# EAGLE design singleLimit (EAGLE 9.6.2)
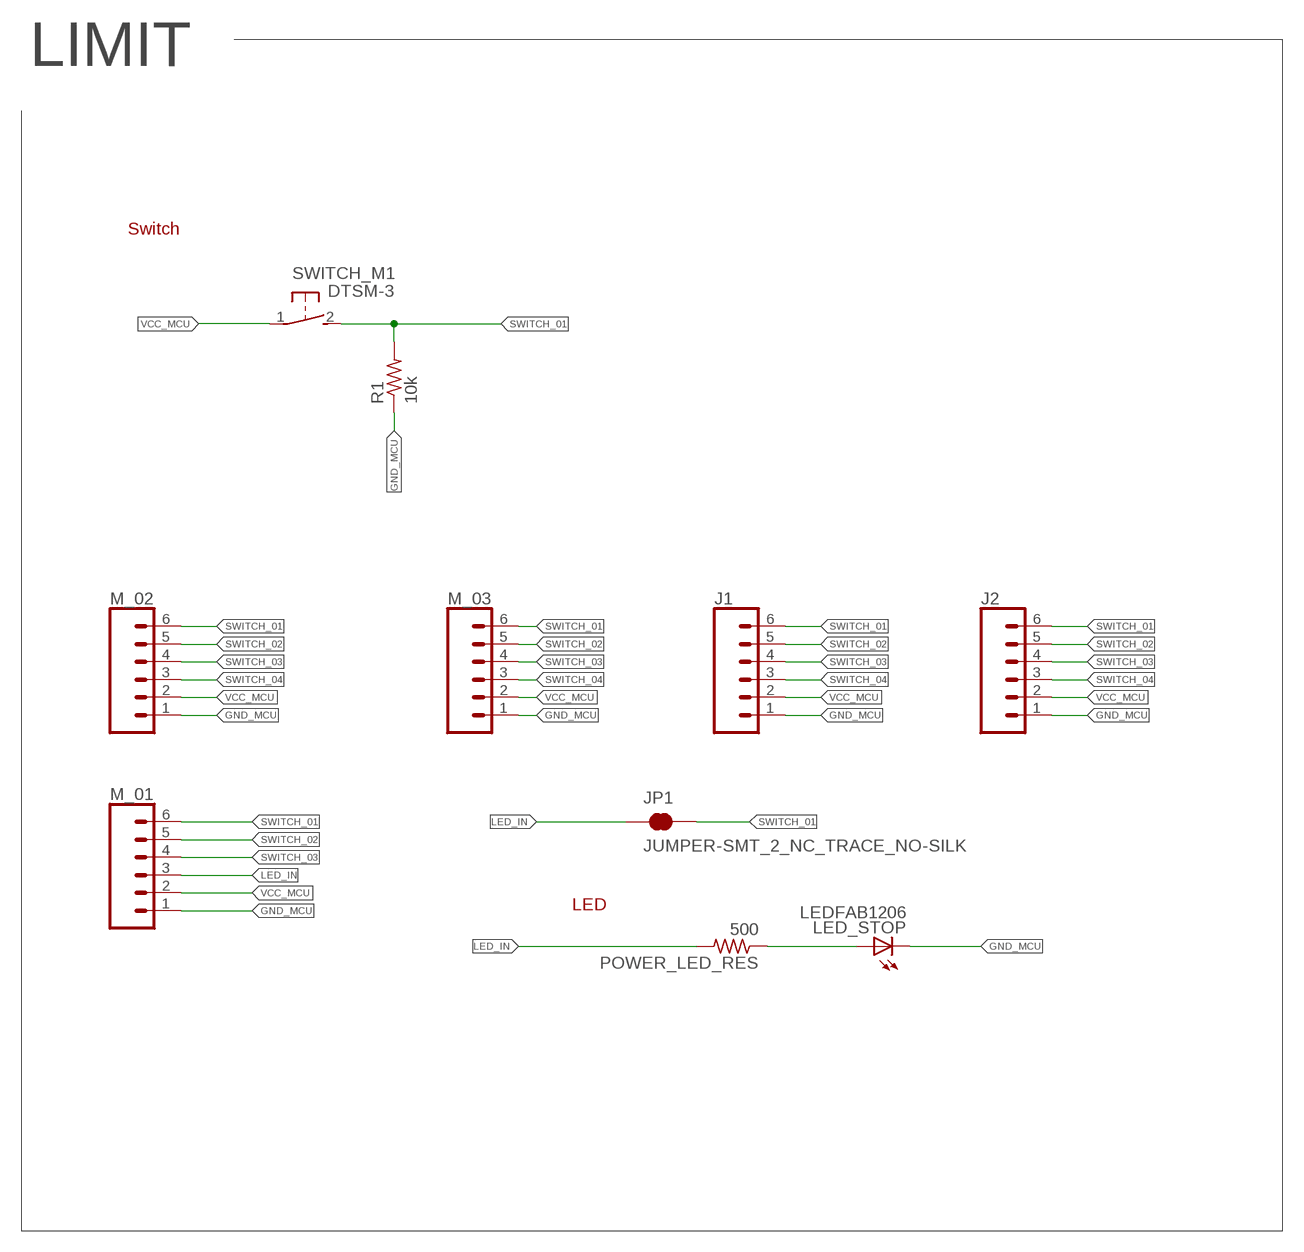
[diagram p0: schematic, sheet 1]

## Parts
J1  CONN_06NO_SILK_FEMALE_PTH  [1X06_NO_SILK]
J2  CONN_06NO_SILK_FEMALE_PTH  [1X06_NO_SILK]
JP1  JUMPER-SMT_2_NC_TRACE_NO-SILK  [SMT-JUMPER_2_NC_TRACE_NO-SILK]
LED_STOP  LEDFAB1206  [LED1206FAB]
M_01  CONN_06SMD-1MM  [1X06-1MM]
M_02  CONN_06SMD-1MM  [1X06-1MM]
M_03  CONN_06SMD-1MM  [1X06-1MM]
POWER_LED_RES  500  R-US_M0805  [M0805]
R1  10k  R-US_M0805  [M0805]
SWITCH_M1  DTSM-3  [DTSM-3]

## Nets
GND_MCU: J1.1 J2.1 LED_STOP.2(C) M_01.1 M_02.1 M_03.1 R1.1
LED_IN: JP1.1 M_01.3 POWER_LED_RES.2
N$11: LED_STOP.1(A) POWER_LED_RES.1
SWITCH_01: J1.6 J2.6 JP1.2 M_01.6 M_02.6 M_03.6 R1.2 SWITCH_M1.2
SWITCH_02: J1.5 J2.5 M_01.5 M_02.5 M_03.5
SWITCH_03: J1.4 J2.4 M_01.4 M_02.4 M_03.4
SWITCH_04: J1.3 J2.3 M_02.3 M_03.3
VCC_MCU: J1.2 J2.2 M_01.2 M_02.2 M_03.2 SWITCH_M1.1

## Notes on the sheet
- LIMIT
- Switch
- LED

## Library data of the parts
J1 J2 = SparkFun-Connectors:CONN_06: Multi connection point. Often used as Generic Header-pin footprint for 0.1 inch spaced/style header connections On any of the 0.1 inch spaced packages, you can populate with these: Break Away Headers - Straight <https://www.sparkfun.com/products/116> (PRT-00116) Break Away Male Headers - Right Angle <https://www.sparkfun.com/products/553> (PRT-00553) Female Headers <https://www.sparkfun.com/products/115> (PRT-00115) Break Away Headers - Machine Pin <https://www.sparkfun.com/products/117> (PRT-00117) Break Away Female Headers - Swiss Machine Pin <https://www.sparkfun.com/products/743> (PRT-00743) Arduino Stackable Header - 6 Pin <https://www.sparkfun.com/products/9280> (PRT-09280) For SCREWTERMINALS and SPRING TERMINALS visit here: Screw Terimnals on SparkFun.com <https://www.sparkfun.com/search/results?term=Screw+Terminals> (5mm/3.5mm/2.54mm spacing) This device is also useful as a general connection point to wire up your design to another part of your project. Our various solder wires solder well into these plated through hole pads. Hook-Up Wire - Assortment (Stranded, 22 AWG) <https://www.sparkfun.com/products/11375> (PRT-11375) Hook-Up Wire - Assortment (Solid Core, 22 AWG) <https://www.sparkfun.com/products/11367> (PRT-11367) View the entire wire category on our website here <https://www.sparkfun.com/categories/141>; PROD_ID: CONN-08437
JP1 = SparkFun-Jumpers:JUMPER-SMT_2_NC_TRACE: Normally closed trace jumper This jumper has a trace between two pads so it's normally closed (NC). Use a razor knife to open the connection. For best results follow the IPC guidelines for cutting traces: Cutout at least 0.063 mm (0.005 in). Remove all loose material to clean up the cut area. Seal the cut with an approved epoxy. Reapply solder to reclose the connection.
LED_STOP = fab:LED: LED
M_01-M_03 = SparkFun-Connectors:CONN_06: Multi connection point. Often used as Generic Header-pin footprint for 0.1 inch spaced/style header connections On any of the 0.1 inch spaced packages, you can populate with these: Break Away Headers - Straight <https://www.sparkfun.com/products/116> (PRT-00116) Break Away Male Headers - Right Angle <https://www.sparkfun.com/products/553> (PRT-00553) Female Headers <https://www.sparkfun.com/products/115> (PRT-00115) Break Away Headers - Machine Pin <https://www.sparkfun.com/products/117> (PRT-00117) Break Away Female Headers - Swiss Machine Pin <https://www.sparkfun.com/products/743> (PRT-00743) Arduino Stackable Header - 6 Pin <https://www.sparkfun.com/products/9280> (PRT-09280) For SCREWTERMINALS and SPRING TERMINALS visit here: Screw Terimnals on SparkFun.com <https://www.sparkfun.com/search/results?term=Screw+Terminals> (5mm/3.5mm/2.54mm spacing) This device is also useful as a general connection point to wire up your design to another part of your project. Our various solder wires solder well into these plated through hole pads. Hook-Up Wire - Assortment (Stranded, 22 AWG) <https://www.sparkfun.com/products/11375> (PRT-11375) Hook-Up Wire - Assortment (Solid Core, 22 AWG) <https://www.sparkfun.com/products/11367> (PRT-11367) View the entire wire category on our website here <https://www.sparkfun.com/categories/141>; PROD_ID: CONN-08249; SF_ID: GPS-00579
POWER_LED_RES R1 = resistor:R-US_: RESISTOR, American symbol
SWITCH_M1 = switch-tact:DTSM-3

## Net classes
0 default: width 0.2 mm, clearance 0.2 mm

## Board
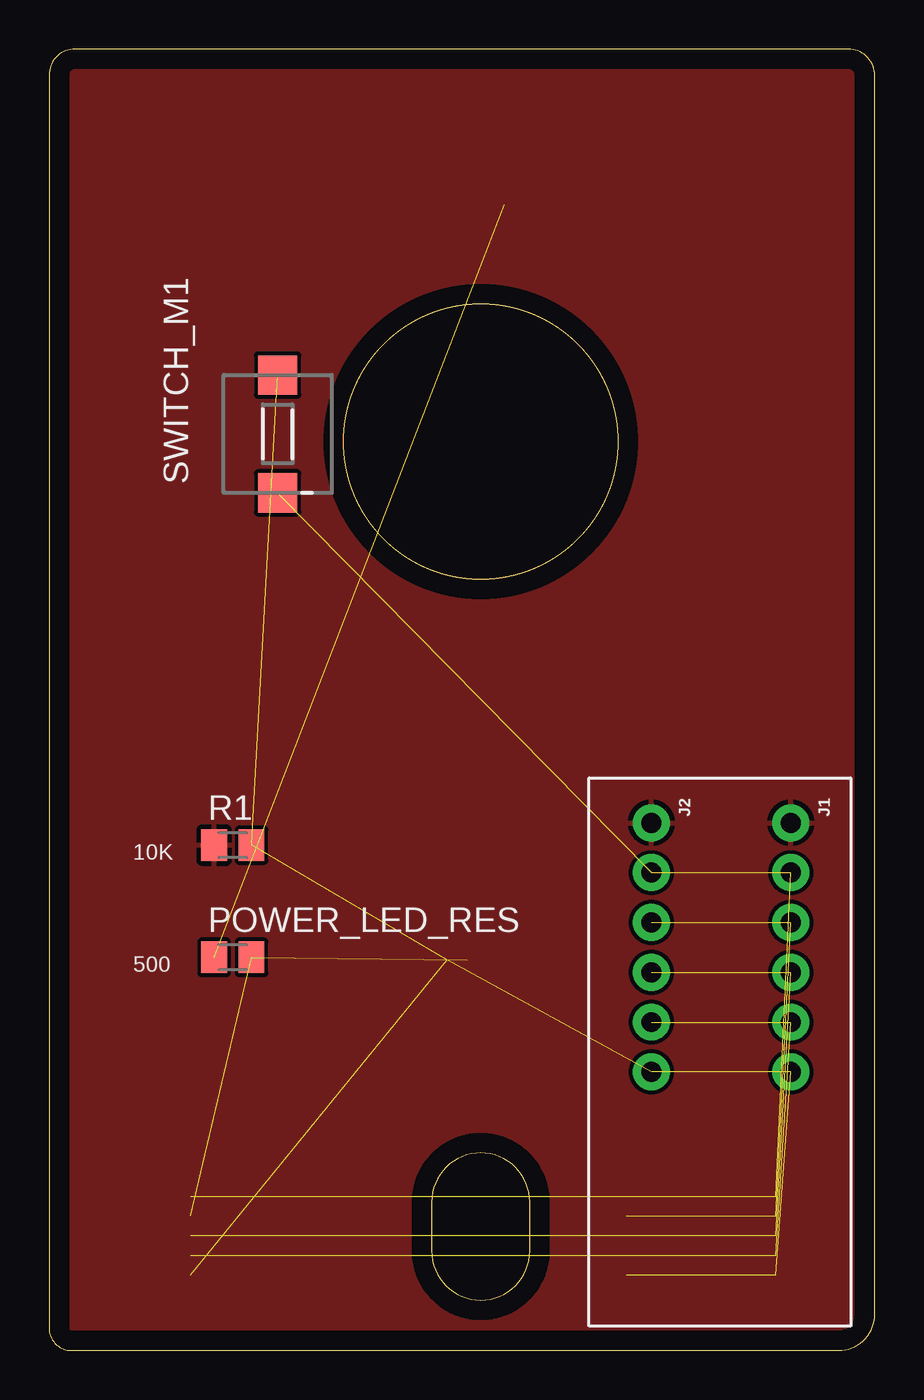
[diagram p1: board, top side]
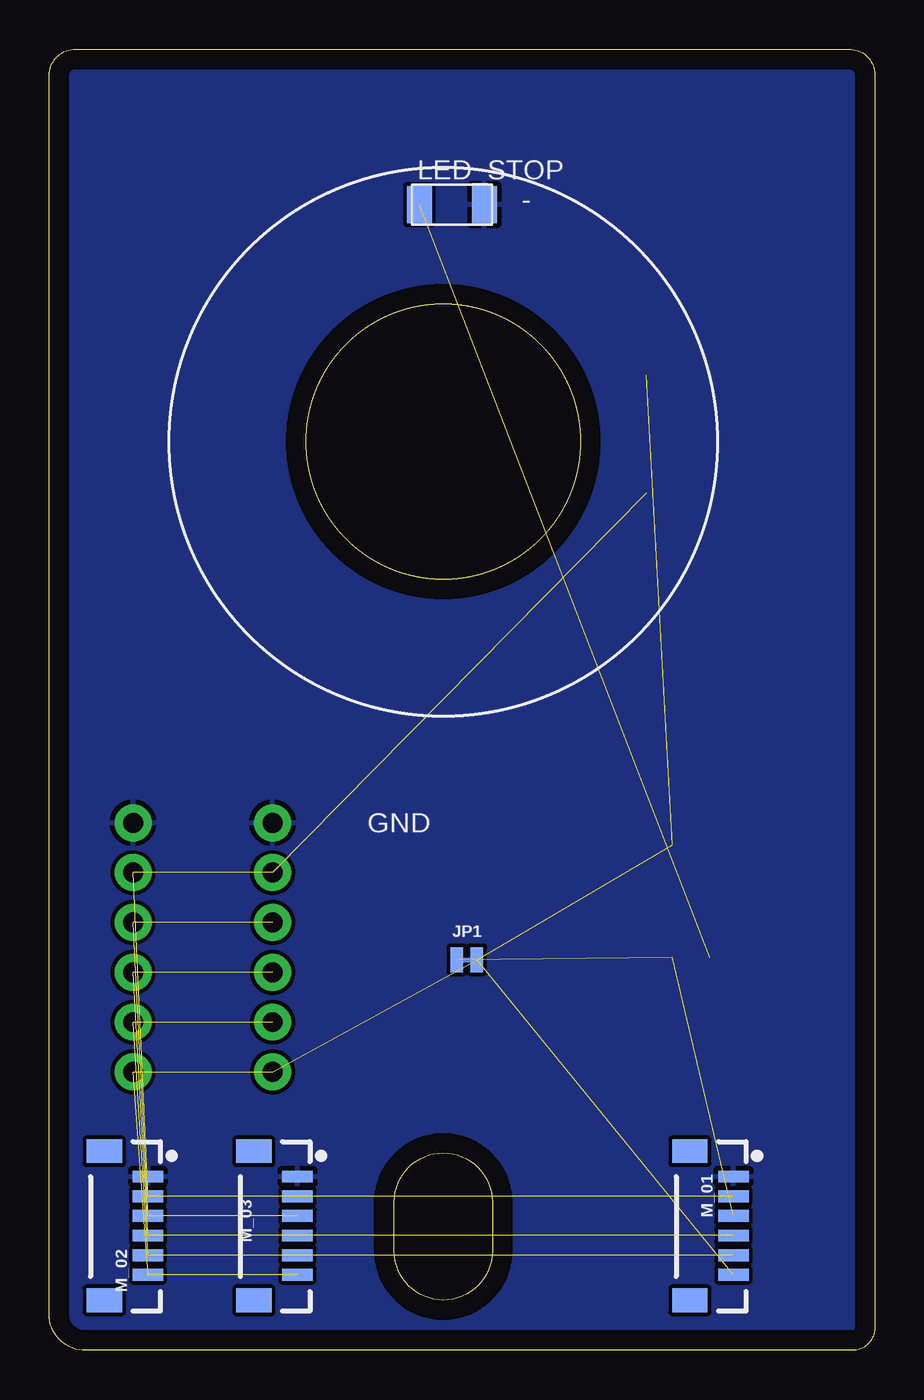
[diagram p2: board, bottom side, seen from below]

Size 42.09 x 66.31 mm. Coordinates in mm from the lower left corner, seen from the top.
Outline: 1.15,0 40.24,0 arc90 42.09,1.85 42.09,64.95 arc90 40.73,66.31 1.33,66.31 arc90 0,64.99 0,1.15 arc90 1.15,0
Outline: 24.5,5.06 24.5,7.56 arc180 19.5,7.56 19.5,5.06 arc180 24.5,5.06
Outline: circle at 22,46.31 radius 7
Copper layers (1*16): Top 0.035mm / dielectric 1.5mm / Bottom 0.035mm
Design rules "default": minimum track width 6mil, minimum drill 0.35mm, track to track 6mil, track to pad 6mil, pad to pad 6mil, via to via 6mil, smd to smd 6mil, copper to edge 40mil, drill to drill 6mil, minimum pad ring 10mil, minimum via ring 8mil, stop-mask expansion 4mil, vias tented up to drill 0mil, thermal gap 10mil

### Footprints (pad centres in the part's own frame; a part is rotated, then mirrored left to right if it is on the bottom)
1X06_NO_SILK = drill 1.016 pad 1.88: 1 0,0; 2 2.54,0; 3 5.08,0; 4 7.62,0; 5 10.16,0; 6 12.7,0
SMT-JUMPER_2_NC_TRACE_NO-SILK = smd 0.635 x 1.27: 1 -0.508,0; 2 0.508,0
LED1206FAB = smd 1.27 x 1.905: 1 -1.651,0; 2 1.651,0
1X06-1MM = smd 0.6 x 1.55: 1 -2.54,1.27; 2 -1.54,1.27; 3 -0.54,1.27; 4 0.46,1.27; 5 1.46,1.27; 6 2.46,1.27 | smd 1.2 x 1.8: P$1 -3.84,-0.955; P$2 3.76,-0.955
M0805 = smd 1.3 x 1.6: 1 -0.95,0; 2 0.95,0
DTSM-3 = smd 2 x 2: 1 -3,0; 2 3,0

### Placement (x,y rotation side)
J1  37.81,26.89 270 top
J2  30.7,26.89 270 top
JP1  20.79,19.9 0 bottom
LED_STOP  21.56,58.39 0 bottom
M_01  8.48,6.31 270 bottom
M_02  38.32,6.31 270 bottom
M_03  30.7,6.31 270 bottom
POWER_LED_RES  9.36,20.03 0 top
R1  9.36,25.75 0 top
SWITCH_M1  11.65,46.7 90 top

### Tracks (layer width: path | path; a pad name or v marks a point on that pad's centre or on a via)
GND_MCU
  pour Top: -6.13,73.62 90.39,73.62 90.39,-5.12 -6.13,-5.12
  pour Bottom: -6.13,71.08 86.58,71.08 86.58,-2.58 -6.13,-2.58
LED_IN  (2 unrouted)
N$11  (1 unrouted)
SWITCH_01  (7 unrouted)
SWITCH_02  (4 unrouted)
SWITCH_03  (4 unrouted)
SWITCH_04  (3 unrouted)
VCC_MCU  (5 unrouted)

### Text on the board
tPlace: 10K | 500
bNames: - | GND